# EAGLE design SparkFun Buck Regulator - AP63203 (EAGLE 9.5.2)
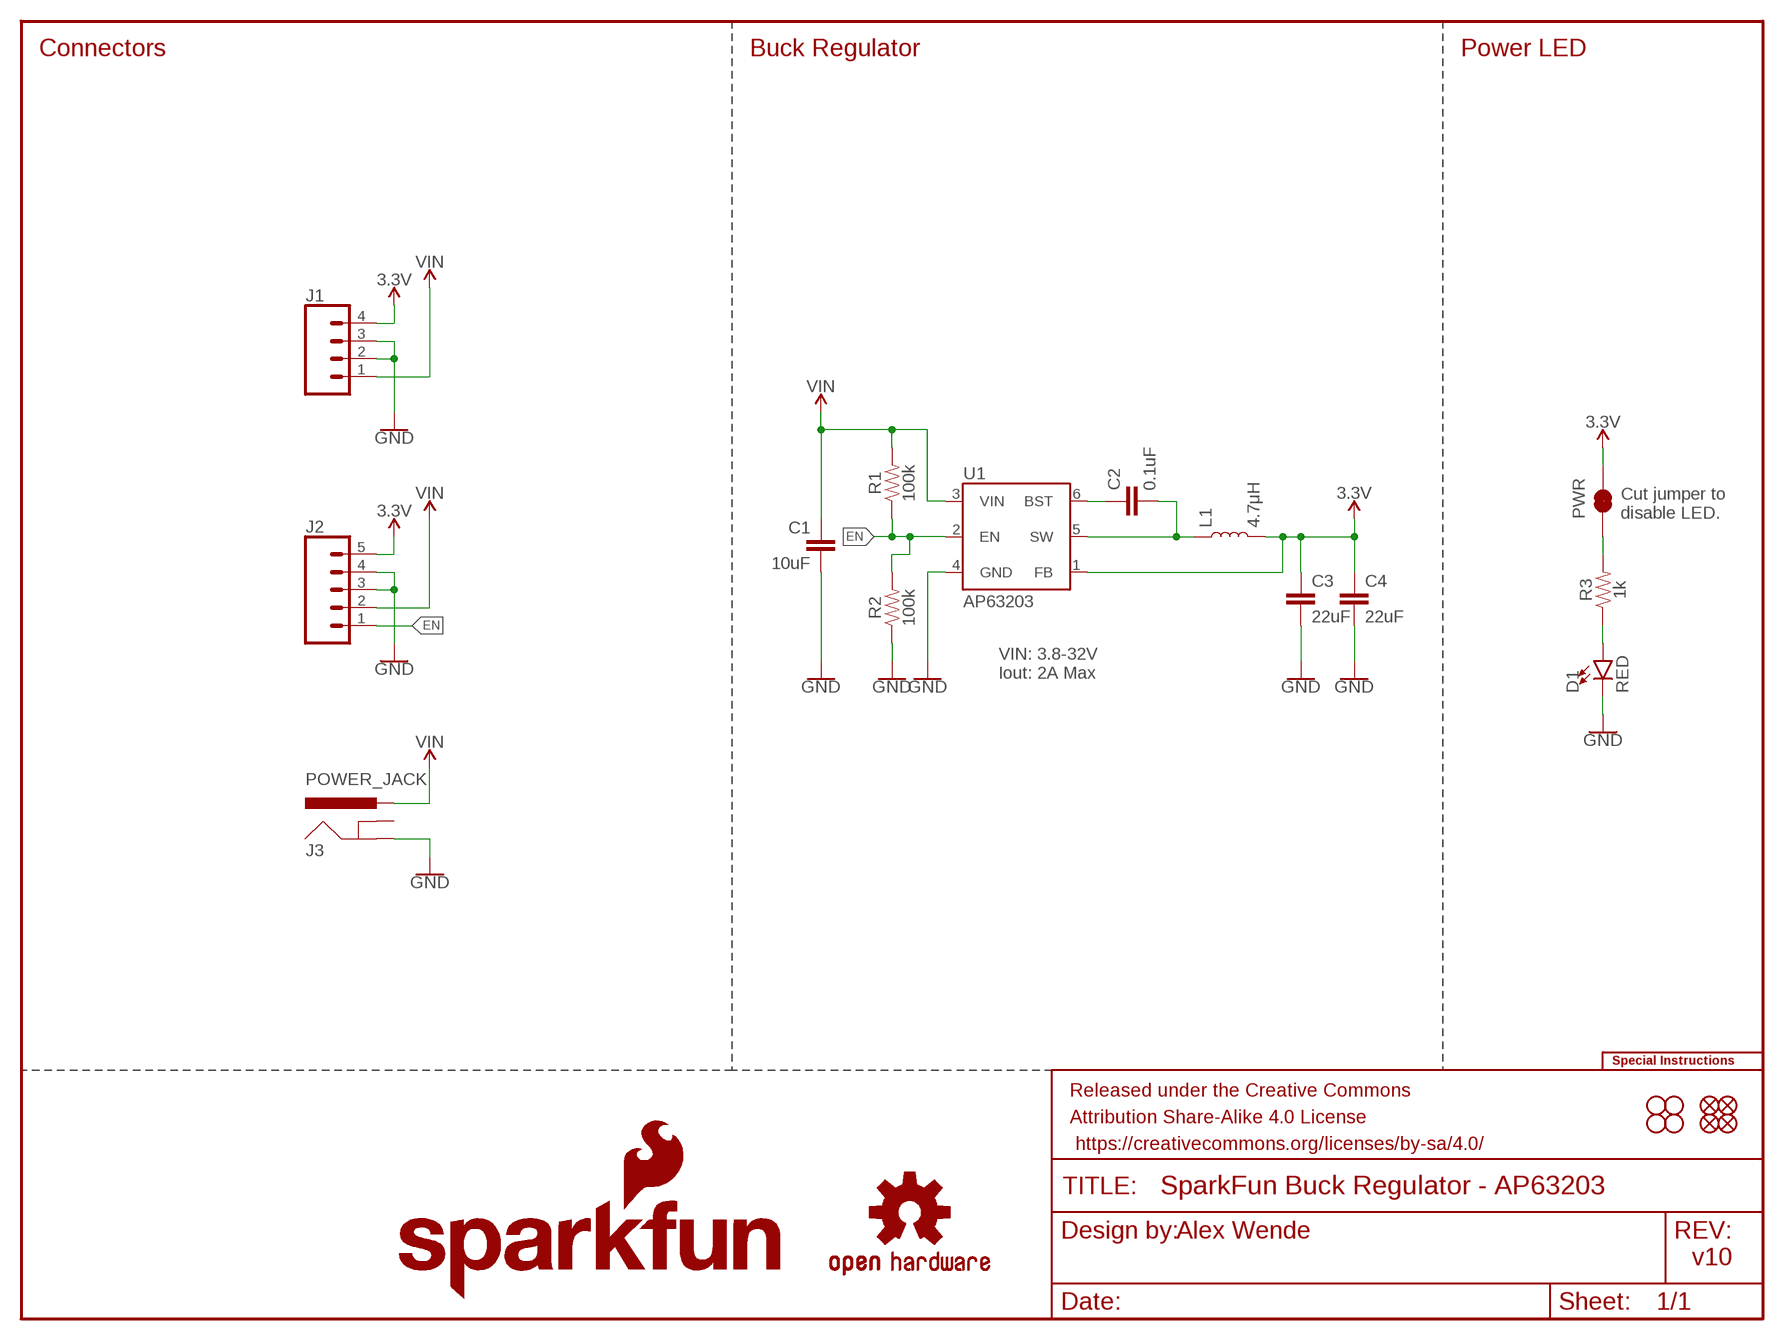
[diagram p0: schematic, sheet 1]

## Parts
C1  10uF  10UF-1210-50V-20%  [1210]
C2  0.1uF  0.1UF-0603-25V-5%  [0603]
C3  22uF  22UF-0603-6.3V-20%  [0603]
C4  22uF  22UF-0603-6.3V-20%  [0603]
D1  RED  LED-RED0603  [LED-0603]
FD1  FIDUCIALUFIDUCIAL  [FIDUCIAL-MICRO]
FD2  FIDUCIALUFIDUCIAL  [FIDUCIAL-MICRO]
FD3  FIDUCIALUFIDUCIAL  [FIDUCIAL-MICRO]
FD4  FIDUCIALUFIDUCIAL  [FIDUCIAL-MICRO]
FRAME1  FRAME-LETTER  [CREATIVE_COMMONS]
H1  STAND-OFF  [STAND-OFF]
H2  STAND-OFF  [STAND-OFF]
H3  STAND-OFF  [STAND-OFF]
H4  STAND-OFF  [STAND-OFF]
J1  CONN_04SCREW  [SCREWTERMINAL-3.5MM-4]
J2  CONN_05NO_SILK  [1X05_NO_SILK]
J3  POWER_JACK  POWER_JACKPOWER_JACK_SLOT  [POWER_JACK_PTH_SLOT]
L1  4.7μH  4.7μH_SHIELDED_INDUCTORNPIS_LS  [INDUCTOR_4X4MM]
LOGO1  SFE_LOGO_NAME_FLAME.1_INCH  [SFE_LOGO_NAME_FLAME_.1]
LOGO2  OSHW-LOGOS  [OSHW-LOGO-S]
LOGO3  SPECIAL_INSTRUCTIONS-ORDERING  [ORDERING_INSTRUCTIONS]
PWR  JUMPER-SMT_2_NC_TRACE_SILK  [SMT-JUMPER_2_NC_TRACE_SILK]
R1  100k  100KOHM-0603-1/10W-1%  [0603]
R2  100k  100KOHM-0603-1/10W-1%  [0603]
R3  1k  1KOHM-0603-1/10W-1%  [0603]
U1  AP63203  [SOT23-6]

## Nets
3.3V: C3.1 C4.1 J1.4 J2.5 L1.P$2 PWR.2 U1.1(FB)
EN: J2.1 R1.1 R2.2 U1.2(EN)
GND: C1.2 C3.2 C4.2 D1.C J1.2 J1.3 J2.3 J2.4 J3.GND R2.1 U1.4(GND)
N$1: D1.A R3.1
N$2: PWR.1 R3.2
N$4: C2.1 U1.6(BST)
N$5: C2.2 L1.P$1 U1.5(SW)
VIN: C1.1 J1.1 J2.2 J3.PWR R1.2 U1.3(VIN)
Unconnected: J3.GNDBREAK

## Notes on the sheet
- Connectors | Buck Regulator | Power LED
- Cut jumper to
  disable LED.
- VIN: 3.8-32V
  Iout: 2A Max
- Alex Wende
- v10

## Library data of the parts
C1 = SparkFun-Capacitors:10UF: 10.0µF ceramic capacitors A capacitor is a passive two-terminal electrical component used to store electrical energy temporarily in an electric field.; PROD_ID: CAP-09824
C2 = SparkFun-Capacitors:0.1UF: 0.1µF ceramic capacitors A capacitor is a passive two-terminal electrical component used to store electrical energy temporarily in an electric field.; PROD_ID: CAP-08604
C3 C4 = SparkFun-Capacitors:22UF: 22µF ceramic capacitors A capacitor is a passive two-terminal electrical component used to store electrical energy temporarily in an electric field.; PROD_ID: CAP-14464
D1 = SparkFun-LED:LED-RED: Red SMD LED Used in manufacturing of most products at SparkFun Packages: 0603 - SMD 0603 package [Product Link] <http://docs.avagotech.com/docs/AV02-0551EN> 0603 SMART - SMD 0603 SMART package ( more efficient and expensive)[Product Link] <http://www.osram-os.com/Graphics/XPic2/00077099_0.pdf> 1206 - SMD1206 package [Product Link] <https://www.sparkfun.com/datasheets/DevTools/LilyPad/Q150OVS4.pdff> SparkFun Products: Pro Mini 328 -5V <https://www.sparkfun.com/products/821> RedBoard <https://www.sparkfun.com/products/12757> IOIO-OTG <https://www.sparkfun.com/products/13613>; PROD_ID: DIO-00819
FD1-FD4 = SparkFun-Aesthetics:FIDUCIAL: Fiducial Alignment Points Point-of-reference for pick-and-place machines and other optical instruments.
FRAME1 = SparkFun-Aesthetics:FRAME-LETTER: Schematic Frame - Letter Standard 8.5x11 US Letter frame
H1-H4 = SparkFun-Hardware:STAND-OFF: Stand Off Drill holes for mechanically mounting via screws, standoffs, etc. Note: Use the keepout ring to avoid running the screw head into surrounding components. Variant Overviews STAND-OFF - Mechanical footprint for a #4 phillips button head screw. STAND-OFF-TIGHT - Mechanical footprint for a #4 phillips button head screw, Example SparkFun Products Screw - Phillips Head (1/4", 4-40, 10 pack) <https://www.sparkfun.com/products/10453> (PRT-10453) Screw - Phillips Head (1/2", 4-40, 10 pack) <https://www.sparkfun.com/products/10452> (PRT-10452) Screw - Phillips Head (3/4", 4-40, 10 pack) <https://www.sparkfun.com/products/10451> (PRT-10451) Screw - Phillips Head (1", 4-40, 10 pack) <https://www.sparkfun.com/products/10450> (PRT-10450)
J1 = SparkFun-Connectors:CONN_04: Multi connection point. Often used as Generic Header-pin footprint for 0.1 inch spaced/style header connections On any of the 0.1 inch spaced packages, you can populate with these: Break Away Headers - Straight <https://www.sparkfun.com/products/116> (PRT-00116) Break Away Male Headers - Right Angle <https://www.sparkfun.com/products/553> (PRT-00553) Female Headers <https://www.sparkfun.com/products/115> (PRT-00115) Break Away Headers - Machine Pin <https://www.sparkfun.com/products/117> (PRT-00117) Break Away Female Headers - Swiss Machine Pin <https://www.sparkfun.com/products/743> (PRT-00743) For SCREWTERMINALS and SPRING TERMINALS visit here: Screw Terimnals on SparkFun.com <https://www.sparkfun.com/search/results?term=Screw+Terminals> (5mm/3.5mm/2.54mm spacing) This device is also useful as a general connection point to wire up your design to another part of your project. Our various solder wires solder well into these plated through hole pads. Hook-Up Wire - Assortment (Stranded, 22 AWG) <https://www.sparkfun.com/products/11375> (PRT-11375) Hook-Up Wire - Assortment (Solid Core, 22 AWG) <https://www.sparkfun.com/products/11367> (PRT-11367) View the entire wire category on our website here <https://www.sparkfun.com/categories/141> Special notes: Molex polarized connector foot print use with SKU : PRT-08231 with associated crimp pins and housings. 1MM SMD Version SKU: PRT-10208; PROD_ID: CONN-14485
J2 = SparkFun-Connectors:CONN_05: Multi connection point. Often used as Generic Header-pin footprint for 0.1 inch spaced/style header connections On any of the 0.1 inch spaced packages, you can populate with these: Break Away Headers - Straight <https://www.sparkfun.com/products/116> (PRT-00116) Break Away Male Headers - Right Angle <https://www.sparkfun.com/products/553> (PRT-00553) Female Headers <https://www.sparkfun.com/products/115> (PRT-00115) Break Away Headers - Machine Pin <https://www.sparkfun.com/products/117> (PRT-00117) Break Away Female Headers - Swiss Machine Pin <https://www.sparkfun.com/products/743> (PRT-00743) For SCREWTERMINALS and SPRING TERMINALS visit here: Screw Terimnals on SparkFun.com <https://www.sparkfun.com/search/results?term=Screw+Terminals> (5mm/3.5mm/2.54mm spacing) This device is also useful as a general connection point to wire up your design to another part of your project. Our various solder wires solder well into these plated through hole pads. Hook-Up Wire - Assortment (Stranded, 22 AWG) <https://www.sparkfun.com/products/11375> (PRT-11375) Hook-Up Wire - Assortment (Solid Core, 22 AWG) <https://www.sparkfun.com/products/11367> (PRT-11367) View the entire wire category on our website here <https://www.sparkfun.com/categories/141> Special notes: Molex polarized connector foot print use with SKU : PRT-08231 with associated crimp pins and housings. 1MM SMD Version SKU: PRT-10208
J3 = SparkFun-Connectors:POWER_JACK: Power Jack Connector This is the standard 5.5mm barrel jack for power. The PTH is the most common, proven, reliable, footprint. The Slot footprint only works if the mill layer is transmitted to the PCB fab house so be warned. Here are the connectors we sell at SparkFun: DC Barrel Power Jack/Connector <https://www.sparkfun.com/products/119> (PRT-00119) DC Barrel Power Jack/Connector (SMD) <https://www.sparkfun.com/products/12748> (PRT-12748) DC Barrel Jack Adapter - Breadboard Compatible <https://www.sparkfun.com/products/10811> (PRT-10811) It is used on this SparkFun product (and many, many others): SparkFun RedBoard - Programmed with Arduino <https://www.sparkfun.com/products/12757> (DEV-12757) Also, if you need a mating power supply or connector, please check these out: Wall Adapter Power Supply - 9VDC 650mA <https://www.sparkfun.com/products/298> (TOL-00298) DC Barrel Jack Adapter - Male <https://www.sparkfun.com/products/10287> (PRT-10287); PROD_ID: CONN-08197
L1 = SparkFun-Coils:4.7μH_SHIELDED_INDUCTOR: 4.7uH Inductor 4.7uH 1.4A 50mOhm 1008(2520) Package Shielded; PROD_ID: NDUC-15245
LOGO1 = SparkFun-Aesthetics:SFE_LOGO_NAME_FLAME: SparkFun Font Logo w/ Flame This is the SparkFun full logo. The logo on the schematic will always be the same size; the package variant is the height of the flame part of the logo. Default layer for the logo on the board is tSilk.
LOGO2 = SparkFun-Aesthetics:OSHW-LOGO: Open-Source Hardware (OSHW) Logo This logo indicates the piece of hardware it is found on incorporates a OSHW license and/or adheres to the definition of open source hardware found here: http://freedomdefined.org/OSHW
LOGO3 = SparkFun-Aesthetics:SPECIAL_INSTRUCTIONS: Special Ordering/Production Instructions Alert Symbol for special PCB ordering instructions or unique production process warnings. Ordering Instructions Production Instructions Types of information that should be added to box: Copper weight Soldermask color Silk color PCB thickness Number of layers PCB Standard: 1.6mm FR4 1 oz copper immersion silver plating red soldermask white silkscreen Types of information that should be added to box: Special wash requirements Depaneling instructions Humidification Glue curing Default text settings: 0.07 inch 9% ratio 50% line distance
PWR = SparkFun-Jumpers:JUMPER-SMT_2_NC_TRACE: Normally closed trace jumper This jumper has a trace between two pads so it's normally closed (NC). Use a razor knife to open the connection. For best results follow the IPC guidelines for cutting traces: Cutout at least 0.063 mm (0.005 in). Remove all loose material to clean up the cut area. Seal the cut with an approved epoxy. Reapply solder to reclose the connection.
R1 R2 = SparkFun-Resistors:100KOHM: 100kΩ resistor A resistor is a passive two-terminal electrical component that implements electrical resistance as a circuit element. Resistors act to reduce current flow, and, at the same time, act to lower voltage levels within circuits. - Wikipedia; PROD_ID: RES-07828
R3 = SparkFun-Resistors:1KOHM: 1kΩ resistor A resistor is a passive two-terminal electrical component that implements electrical resistance as a circuit element. Resistors act to reduce current flow, and, at the same time, act to lower voltage levels within circuits. - Wikipedia; PROD_ID: RES-07856
U1 = SparkFun-IC-Power:AP63203: Diodes Inc. AP63203 3.8V-32V input 3.3V Buck The AP63200/AP63201/AP63203/AP63205 is a 2A, synchronous buck converter with a wide input voltage range of 3.8V to 32V and fully integrates a 125mΩ high-side power MOSFET and a 68mΩ lowside power MOSFET to provide high-efficiency step-down DC/DC conversion; PROD_ID: VREG-15244

## Board
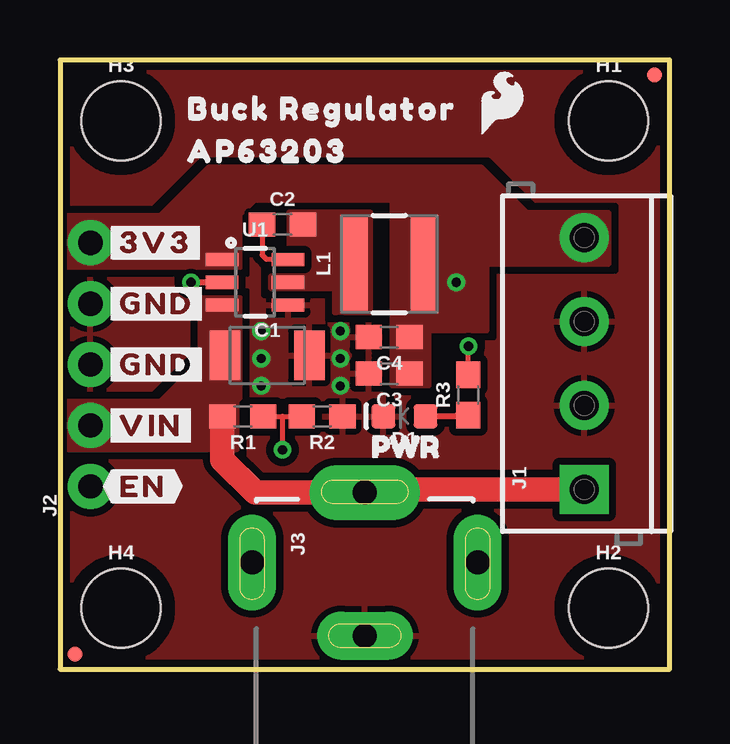
[diagram p1: board, top side]
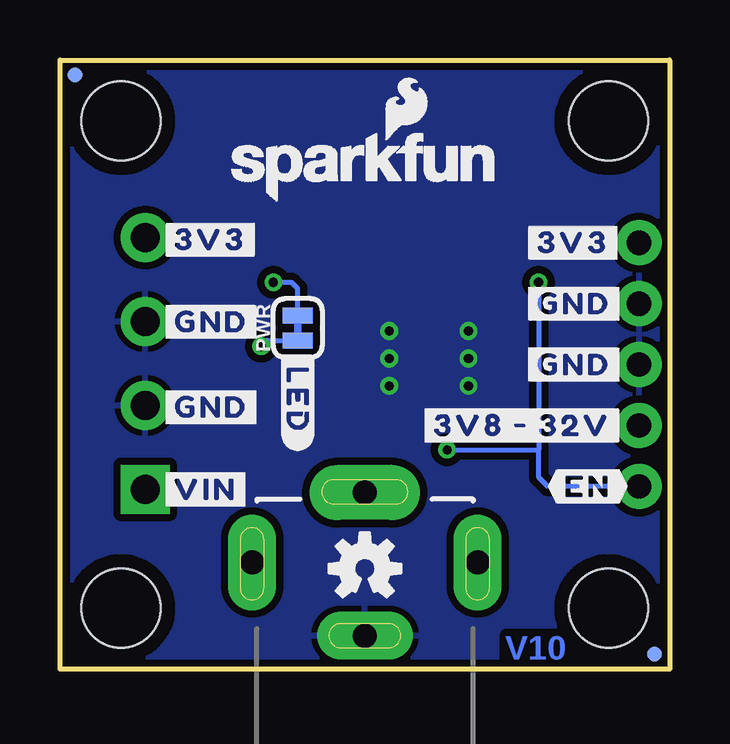
[diagram p2: board, bottom side, seen from below]

Size 25.4 x 25.4 mm. Coordinates in mm from the lower left corner, seen from the top.
Outline: 0,0 25.4,0 25.4,25.4 0,25.4 0,0
Copper layers (1*16): Top 0.035mm / dielectric 1.5mm / Bottom 0.035mm
Design rules "SparkFun-2-Layer-General-JLCPCB": minimum track width 7mil, minimum drill 0.3mm, track to track 7mil, track to pad 7mil, pad to pad 7mil, via to via 7mil, smd to smd 7mil, copper to edge 7mil, drill to drill 7mil, minimum pad ring 7mil, minimum via ring 7mil, stop-mask expansion 3mil, vias tented up to drill 25mil, thermal gap 10mil

### Footprints (pad centres in the part's own frame; a part is rotated, then mirrored left to right if it is on the bottom)
1210 = smd 1.27 x 2.06: 1 -1.755,0; 2 1.755,0
0603 = smd 1.1 x 1: 1 -0.85,0; 2 0.85,0
LED-0603 = smd 1 x 1: A -0.877,0; C 0.877,0
FIDUCIAL-MICRO = smd 0.635 x 0.635: 1 0,0
STAND-OFF = hole 3.302: 0,0
SCREWTERMINAL-3.5MM-4 = drill 1.2 pad 2.032 square: 1 0,0 | drill 1.2 pad 2.032: 2 3.5,0; 3 7,0; 4 10.5,0
1X05_NO_SILK = drill 1.016 pad 1.88: 1 0,0; 2 2.54,0; 3 5.08,0; 4 7.62,0; 5 10.16,0
POWER_JACK_PTH_SLOT = drill 1 pad 2 long: GND 0,0; GNDBREAK -3.048,4.699; GNDBREAK1 -3.048,-4.699 | drill 1 pad 2.3 long: PWR -5.969,0
INDUCTOR_4X4MM = smd 4.089 x 1.143: P$1 0,1.473; P$2 0,-1.473
SMT-JUMPER_2_NC_TRACE_SILK = smd 0.66 x 1.27: 1 -0.521,0; 2 0.521,0
SOT23-6 = smd 0.55 x 1.35: 1 -0.95,-1.375; 2 0,-1.375; 3 0.95,-1.375; 4 0.95,1.375; 5 0,1.375; 6 -0.95,1.375

### Placement (x,y rotation side)
C1  8.64,13.08 0 top
C2  9.27,18.54 0 top
C3  13.72,12.32 180 top
C4  13.72,13.84 180 top
D1  14.35,10.54 180 top
FD1  0.64,0.64 0 top
FD2  24.77,24.77 0 top
FD3  0.64,0.64 0 bottom
FD4  24.77,24.77 0 bottom
FRAME1  -8.89,-16.51 0 top  (outside the outline)
H1  22.86,22.86 0 top
H2  22.86,2.54 0 top
H3  2.54,22.86 0 top
H4  2.54,2.54 0 top
J1  21.84,7.49 90 top
J2  1.27,7.62 90 top
J3  12.7,1.4 270 top
L1  13.72,16.89 90 top
LOGO1  12.7,20.95 0 bottom
LOGO2  12.7,4.19 0 bottom
LOGO3  38.1,43.18 0 top  (outside the outline)
PWR  15.49,14.22 90 bottom
R1  7.62,10.54 180 top
R2  10.92,10.54 180 top
R3  17.02,11.43 90 top
U1  8.13,16.13 270 top
U$1  [#3V3#0]  1.78,17.78 0 top
U$2  [#3V3#0]  21.34,17.91 0 bottom
U$3  [#GND#0]  1.78,12.7 0 top
U$4  [#GND#0]  21.34,14.48 0 bottom
U$5  [#GND#0]  21.34,10.92 0 bottom
U$6  [#VIN#0]  1.78,10.16 0 top
U$7  [#EN#0]  1.78,7.62 0 top
U$8  [#VIN#0]  21.34,7.49 0 bottom
U$9  [#3V8_#_32V#0]  10.54,10.16 0 bottom
U$10  [#GND#0]  1.78,15.24 0 top
U$11  [#GND#0]  6.22,12.7 0 bottom
U$12  [#GND#0]  6.22,15.24 0 bottom
U$13  [#3V3#0]  6.22,17.78 0 bottom
U$14  [#EN#0]  5.08,7.62 0 bottom
U$15  [BUCK_REGULATOR0]  10.92,23.37 0 top
U$16  [#LED#0]  15.49,13.34 270 bottom
U$17  [SFE_LOGO_FLAME_.1]  18.41,23.62 0 top
U$18  [PWR1]  12.19,9.27 0 top
U$20  [AP632030]  8.64,21.59 0 top

### Tracks (layer width: path | path; a pad name or v marks a point on that pad's centre or on a via)
3.3V  (via drill 0.38)
  Top 0.508: 15.19,17.14 L1.P$2
  Bottom 0.203: PWR.2 15.49,15.88 15.75,16.13 v16.51,16.13
  pour Top (no thermals): 6.22,20.95 17.53,20.95 19.43,19.05 22.86,19.05 22.86,16.87 17.78,16.87 17.78,14.1 15.37,14.1 15.37,11.81 13.84,11.81 13.84,19.54 8.11,19.54 7.49,18.92 7.49,16.74 0.02,16.74 0,16.76 0,18.92 4.19,18.92
EN  (via drill 0.38)
  Top 0.203: R1.1 9.27,10.54 | 9.27,10.54 R2.2 | v9.27,9.14 9.27,10.54
  Top 0.254: U1.2 v5.46,16.13
  Bottom 0.203: J2.1 5.08,7.62 5.46,8 5.46,9.14 | v9.27,9.14 5.46,9.14 | v5.46,16.13 5.46,9.14
GND  (via drill 0.38)
  other vias: 8.38,14.1 11.68,14.1 11.68,12.95 11.68,11.81 8.38,12.95 8.38,11.81
  pour Bottom (isolate 0.305, rank 2): 0,25.4 25.4,25.4 25.4,0 0,0
  pour Top (isolate 0.305, rank 2): 0,25.4 25.4,25.4 25.4,0 0,0
N$1
  Top 0.254: R3.1 16.55,10.58 16.51,10.54 D1.A
N$2  (via drill 0.38)
  Top 0.203: R3.2 v17.02,13.46
  Bottom 0.203: v17.02,13.46 16.78,13.7 PWR.1
N$4
  Top 0.203: U1.6 8.61,17.08 8.42,17.27 C2.1
N$5
  pour Top (isolate 0.305, no thermals): 8.76,15.88 11.43,15.88 11.43,14.86 12.95,14.86 12.95,19.05 9.53,19.05 9.53,16.38 8.76,16.38
VIN
  Top 0.813: 12.83,7.49 J3.PWR
  Top 1.016: J1.1 12.83,7.49 | J3.PWR 8.13,7.37 6.77,8.72 R1.2
  pour Top (no thermals): 7.49,15.49 7.49,11.3 7.37,11.18 7.37,9.14 0,9.14 0,11.18 4.19,11.18 5.84,12.83 5.84,15.49

### Text on the board
Bottom: V10
tDocu: 2oz copper | Alex Wende